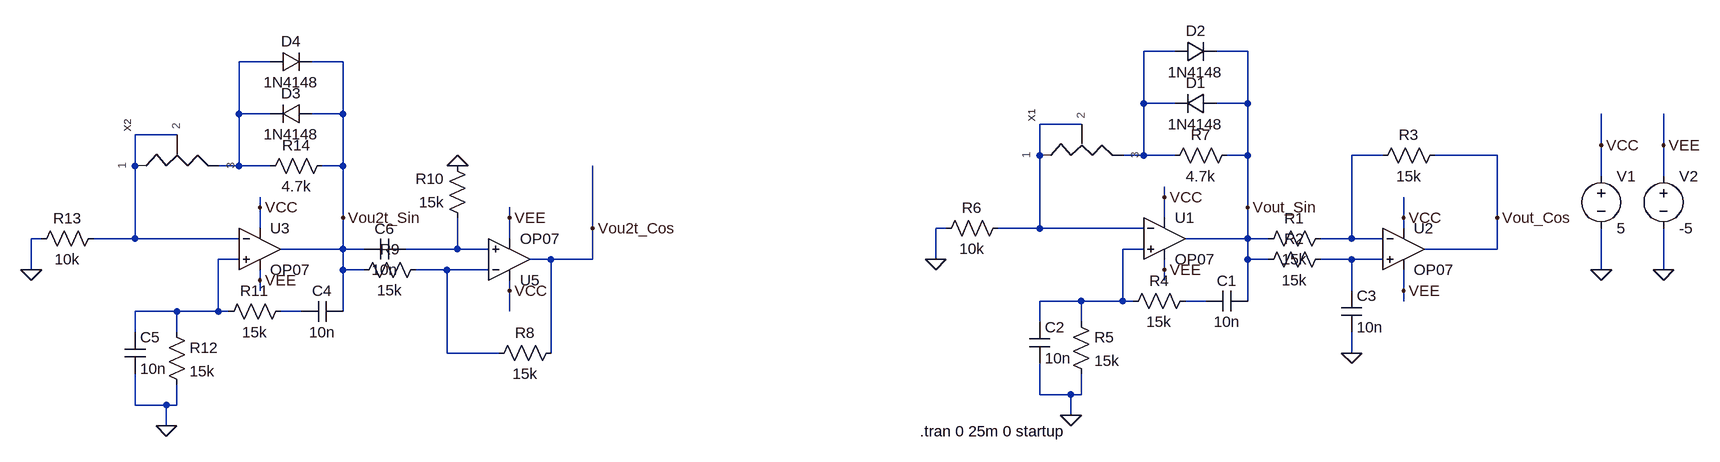
[diagram p0: schematic 1_10.asc]
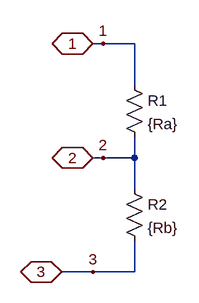
[diagram p1: sub-circuit dian_wei_qi.asc]
1_10.asc, the LTspice schematic file:
Version 4
SHEET 1 904 680
WIRE 96 -128 48 -128
WIRE 208 -128 160 -128
WIRE -1296 -112 -1344 -112
WIRE -1184 -112 -1232 -112
WIRE 48 -48 48 -128
WIRE 96 -48 48 -48
WIRE 208 -48 208 -128
WIRE 208 -48 160 -48
WIRE -1344 -32 -1344 -112
WIRE -1296 -32 -1344 -32
WIRE -1184 -32 -1184 -112
WIRE -1184 -32 -1232 -32
WIRE -48 -16 -112 -16
WIRE -1440 0 -1504 0
WIRE 752 16 752 -32
WIRE 848 16 848 -32
WIRE -112 32 -112 -16
WIRE 48 32 48 -48
WIRE 48 32 16 32
WIRE 96 32 48 32
WIRE 208 32 208 -48
WIRE 208 32 176 32
WIRE 416 32 368 32
WIRE 592 32 496 32
WIRE -1504 48 -1504 0
WIRE -1344 48 -1344 -32
WIRE -1344 48 -1376 48
WIRE -1296 48 -1344 48
WIRE -1184 48 -1184 -32
WIRE -1184 48 -1216 48
WIRE 752 64 752 16
WIRE 848 64 848 16
WIRE 80 96 80 80
WIRE -1312 112 -1312 96
WIRE 208 112 208 32
WIRE -1184 128 -1184 48
WIRE -928 128 -928 112
WIRE 80 128 80 96
WIRE 448 128 448 96
WIRE 592 128 592 32
WIRE -1312 144 -1312 112
WIRE -800 144 -800 48
WIRE -256 144 -272 144
WIRE -112 144 -112 32
WIRE -112 144 -176 144
WIRE 48 144 -112 144
WIRE 448 144 448 128
WIRE -1648 160 -1664 160
WIRE -1504 160 -1504 48
WIRE -1504 160 -1568 160
WIRE -1344 160 -1504 160
WIRE -928 160 -928 128
WIRE 208 160 208 112
WIRE 208 160 112 160
WIRE 240 160 208 160
WIRE 368 160 368 32
WIRE 368 160 320 160
WIRE 416 160 368 160
WIRE -1184 176 -1184 128
WIRE -1184 176 -1280 176
WIRE -1152 176 -1184 176
WIRE -1008 176 -1008 128
WIRE -1008 176 -1088 176
WIRE -960 176 -1008 176
WIRE 48 176 16 176
WIRE 592 176 592 128
WIRE 592 176 480 176
WIRE -1344 192 -1376 192
WIRE -864 192 -896 192
WIRE -800 192 -800 144
WIRE -800 192 -864 192
WIRE -272 192 -272 144
WIRE 208 192 208 160
WIRE 240 192 208 192
WIRE 368 192 320 192
WIRE 416 192 368 192
WIRE -1664 208 -1664 160
WIRE -1184 208 -1184 176
WIRE -1152 208 -1184 208
WIRE -1024 208 -1072 208
WIRE -960 208 -1024 208
WIRE 80 208 80 192
WIRE 752 208 752 144
WIRE 848 208 848 144
WIRE -1312 224 -1312 208
WIRE 80 224 80 208
WIRE -1312 240 -1312 224
WIRE -928 240 -928 224
WIRE 368 240 368 192
WIRE 448 240 448 208
WIRE -48 256 -112 256
WIRE 16 256 16 176
WIRE 16 256 -48 256
WIRE 32 256 16 256
WIRE 144 256 112 256
WIRE 208 256 208 192
WIRE 448 256 448 240
WIRE -1440 272 -1504 272
WIRE -1376 272 -1376 192
WIRE -1376 272 -1440 272
WIRE -1360 272 -1376 272
WIRE -1248 272 -1280 272
WIRE -1184 272 -1184 208
WIRE -928 272 -928 240
WIRE -112 288 -112 256
WIRE -48 288 -48 256
WIRE -1504 304 -1504 272
WIRE -1440 304 -1440 272
WIRE -1024 336 -1024 208
WIRE -944 336 -1024 336
WIRE -864 336 -864 192
WIRE 368 336 368 304
WIRE -112 400 -112 352
WIRE -64 400 -112 400
WIRE -48 400 -48 368
WIRE -48 400 -64 400
WIRE -1504 416 -1504 368
WIRE -1456 416 -1504 416
WIRE -1440 416 -1440 384
WIRE -1440 416 -1456 416
WIRE -64 432 -64 400
WIRE -1456 448 -1456 416
FLAG -272 192 0
FLAG -64 432 0
FLAG 368 336 0
FLAG 752 208 0
FLAG 848 208 0
FLAG 80 96 VCC
FLAG 448 128 VCC
FLAG 752 16 VCC
FLAG 80 208 VEE
FLAG 448 240 VEE
FLAG 848 16 VEE
FLAG 208 112 Vout_Sin
FLAG 592 128 Vout_Cos
FLAG -1664 208 0
FLAG -1456 448 0
FLAG -1312 112 VCC
FLAG -1312 224 VEE
FLAG -1184 128 Vou2t_Sin
FLAG -800 144 Vou2t_Cos
FLAG -1008 48 0
FLAG -928 240 VCC
FLAG -928 128 VEE
SYMBOL OpAmps\\OP07 80 96 R0
SYMATTR InstName U1
SYMBOL OpAmps\\OP07 448 112 R0
SYMATTR InstName U2
SYMBOL res 336 144 R90
WINDOW 0 0 56 VBottom 2
WINDOW 3 32 56 VTop 2
SYMATTR InstName R1
SYMATTR Value 15k
SYMBOL res 336 176 R90
WINDOW 0 0 56 VBottom 2
WINDOW 3 32 56 VTop 2
SYMATTR InstName R2
SYMATTR Value 15k
SYMBOL res 512 16 R90
WINDOW 0 0 56 VBottom 2
WINDOW 3 32 56 VTop 2
SYMATTR InstName R3
SYMATTR Value 15k
SYMBOL res 128 240 R90
WINDOW 0 0 56 VBottom 2
WINDOW 3 32 56 VTop 2
SYMATTR InstName R4
SYMATTR Value 15k
SYMBOL cap 208 240 R90
WINDOW 0 0 32 VBottom 2
WINDOW 3 32 32 VTop 2
SYMATTR InstName C1
SYMATTR Value 10n
SYMBOL res -64 272 R0
SYMATTR InstName R5
SYMATTR Value 15k
SYMBOL cap -128 288 R0
SYMATTR InstName C2
SYMATTR Value 10n
SYMBOL res -160 128 R90
WINDOW 0 0 56 VBottom 2
WINDOW 3 32 56 VTop 2
SYMATTR InstName R6
SYMATTR Value 10k
SYMBOL dian_wei_qi -48 48 R270
SYMATTR InstName X1
SYMATTR SpiceLine Ra=1,Rb=16.5k
SYMBOL res 192 16 R90
WINDOW 0 0 56 VBottom 2
WINDOW 3 32 56 VTop 2
SYMATTR InstName R7
SYMATTR Value 4.7k
SYMBOL diode 160 -64 R90
WINDOW 0 0 32 VBottom 2
WINDOW 3 32 32 VTop 2
SYMATTR InstName D1
SYMATTR Value 1N4148
SYMBOL diode 96 -112 R270
WINDOW 0 32 32 VTop 2
WINDOW 3 0 32 VBottom 2
SYMATTR InstName D2
SYMATTR Value 1N4148
SYMBOL cap 352 240 R0
SYMATTR InstName C3
SYMATTR Value 10n
SYMBOL voltage 752 48 R0
WINDOW 123 0 0 Left 0
WINDOW 39 0 0 Left 0
SYMATTR InstName V1
SYMATTR Value 5
SYMBOL voltage 848 48 R0
WINDOW 123 0 0 Left 0
WINDOW 39 0 0 Left 0
SYMATTR InstName V2
SYMATTR Value -5
SYMBOL OpAmps\\OP07 -1312 112 R0
SYMATTR InstName U3
SYMBOL res -1056 192 R90
WINDOW 0 0 56 VBottom 2
WINDOW 3 32 56 VTop 2
SYMATTR InstName R9
SYMATTR Value 15k
SYMBOL res -1264 256 R90
WINDOW 0 0 56 VBottom 2
WINDOW 3 32 56 VTop 2
SYMATTR InstName R11
SYMATTR Value 15k
SYMBOL cap -1184 256 R90
WINDOW 0 0 32 VBottom 2
WINDOW 3 32 32 VTop 2
SYMATTR InstName C4
SYMATTR Value 10n
SYMBOL res -1456 288 R0
SYMATTR InstName R12
SYMATTR Value 15k
SYMBOL cap -1520 304 R0
SYMATTR InstName C5
SYMATTR Value 10n
SYMBOL res -1552 144 R90
WINDOW 0 0 56 VBottom 2
WINDOW 3 32 56 VTop 2
SYMATTR InstName R13
SYMATTR Value 10k
SYMBOL dian_wei_qi -1440 64 R270
SYMATTR InstName X2
SYMATTR SpiceLine Ra=1,Rb=16.5k
SYMBOL res -1200 32 R90
WINDOW 0 0 56 VBottom 2
WINDOW 3 32 56 VTop 2
SYMATTR InstName R14
SYMATTR Value 4.7k
SYMBOL diode -1232 -48 R90
WINDOW 0 0 32 VBottom 2
WINDOW 3 32 32 VTop 2
SYMATTR InstName D3
SYMATTR Value 1N4148
SYMBOL diode -1296 -96 R270
WINDOW 0 32 32 VTop 2
WINDOW 3 0 32 VBottom 2
SYMATTR InstName D4
SYMATTR Value 1N4148
SYMBOL cap -1088 160 R90
WINDOW 0 0 32 VBottom 2
WINDOW 3 32 32 VTop 2
SYMATTR InstName C6
SYMATTR Value 10n
SYMBOL res -848 320 R90
WINDOW 0 0 56 VBottom 2
WINDOW 3 32 56 VTop 2
SYMATTR InstName R8
SYMATTR Value 15k
SYMBOL res -992 144 R180
WINDOW 0 36 76 Left 2
WINDOW 3 36 40 Left 2
SYMATTR InstName R10
SYMATTR Value 15k
SYMBOL OpAmps\\OP07 -928 256 M180
SYMATTR InstName U5
TEXT -296 456 Left 2 !.tran 0 25m 0 startup

dian_wei_qi.asc, the sub-circuit schematic file:
Version 4
SHEET 1 880 680
WIRE 144 -32 128 -32
WIRE 192 -32 144 -32
WIRE 192 32 192 -32
WIRE 144 144 128 144
WIRE 192 144 192 112
WIRE 192 144 144 144
WIRE 192 192 192 144
WIRE 128 320 80 320
WIRE 192 320 192 272
WIRE 192 320 128 320
FLAG 144 -32 1
FLAG 144 144 2
FLAG 128 320 3
FLAG 128 -32 1
IOPIN 128 -32 BiDir
FLAG 128 144 2
IOPIN 128 144 BiDir
FLAG 80 320 3
IOPIN 80 320 BiDir
SYMBOL res 176 16 R0
SYMATTR InstName R1
SYMATTR Value {Ra}
SYMBOL res 176 176 R0
SYMATTR InstName R2
SYMATTR Value {Rb}

The netlist it stands for:
* 1_10.asc
XU1 N007 N003 VCC VEE Vout_Sin LT1001  ; OP07, pins In+ In- V+ V- OUT
XU2 N009 N005 VCC VEE Vout_Cos LT1001  ; OP07, pins In+ In- V+ V- OUT
R1 N005 Vout_Sin 15k
R2 N009 Vout_Sin 15k
R3 Vout_Cos N005 15k
R4 N011 N007 15k
C1 Vout_Sin N011 10n
R5 N007 0 15k
C2 N007 0 10n
R6 N003 0 10k
XX1 N003 N003 N001 dian_wei_qi params: Ra=1,Rb=16.5k
R7 Vout_Sin N001 4.7k
D1 Vout_Sin N001 1N4148
D2 N001 Vout_Sin 1N4148
C3 N009 0 10n
V1 VCC 0 5
V2 VEE 0 -5
XU3 N008 N004 VCC VEE Vou2t_Sin LT1001  ; OP07, pins In+ In- V+ V- OUT
R9 N010 Vou2t_Sin 15k
R11 N012 N008 15k
C4 Vou2t_Sin N012 10n
R12 N008 0 15k
C5 N008 0 10n
R13 N004 0 10k
XX2 N004 N004 N002 dian_wei_qi params: Ra=1,Rb=16.5k
R14 Vou2t_Sin N002 4.7k
D3 Vou2t_Sin N002 1N4148
D4 N002 Vou2t_Sin 1N4148
C6 N006 Vou2t_Sin 10n
R8 Vou2t_Cos N010 15k
R10 N006 0 15k
XU5 N006 N010 VCC VEE Vou2t_Cos LT1001  ; OP07, pins In+ In- V+ V- OUT

* block symbol definitions
.subckt dian_wei_qi 1 2 3
R1 1 2 {Ra}
R2 2 3 {Rb}
.ends dian_wei_qi

.model D D
.lib standard.dio
.tran 0 25m 0 startup
.lib LTC.lib
.backanno
.end

* Results of the author's LTspice run, read from the files saved beside the schematic
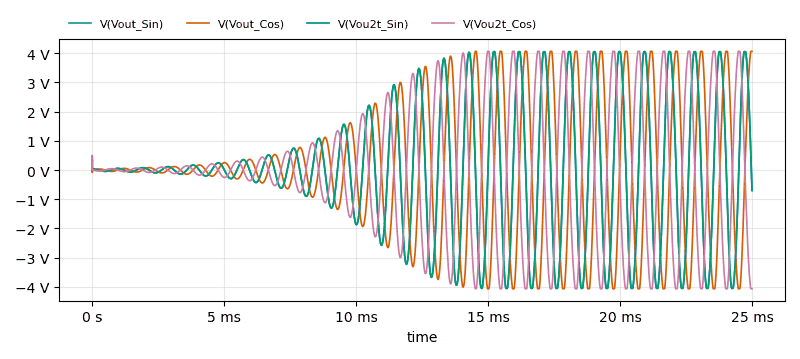
[diagram p2: Transient Analysis of 1_10.asc, plotted from the saved traces]
* Transient Analysis, 1 run:
*   V(Vout_Sin): min -4.05 V, max 4.05 V, average 25.12 mV, rms 2.173 V, last -696.8 mV
*   V(Vout_Cos): min -4.064 V, max 4.064 V, average 4.608 mV, rms 2.158 V, last 4.063 V
*   V(Vou2t_Sin): min -4.05 V, max 4.05 V, average 25.12 mV, rms 2.173 V, last -701 mV
*   V(Vou2t_Cos): min -4.065 V, max 4.065 V, average -4.464 mV, rms 2.158 V, last -4.065 V